# EAGLE design Kenbak-nanoduino (EAGLE 9.2.0)
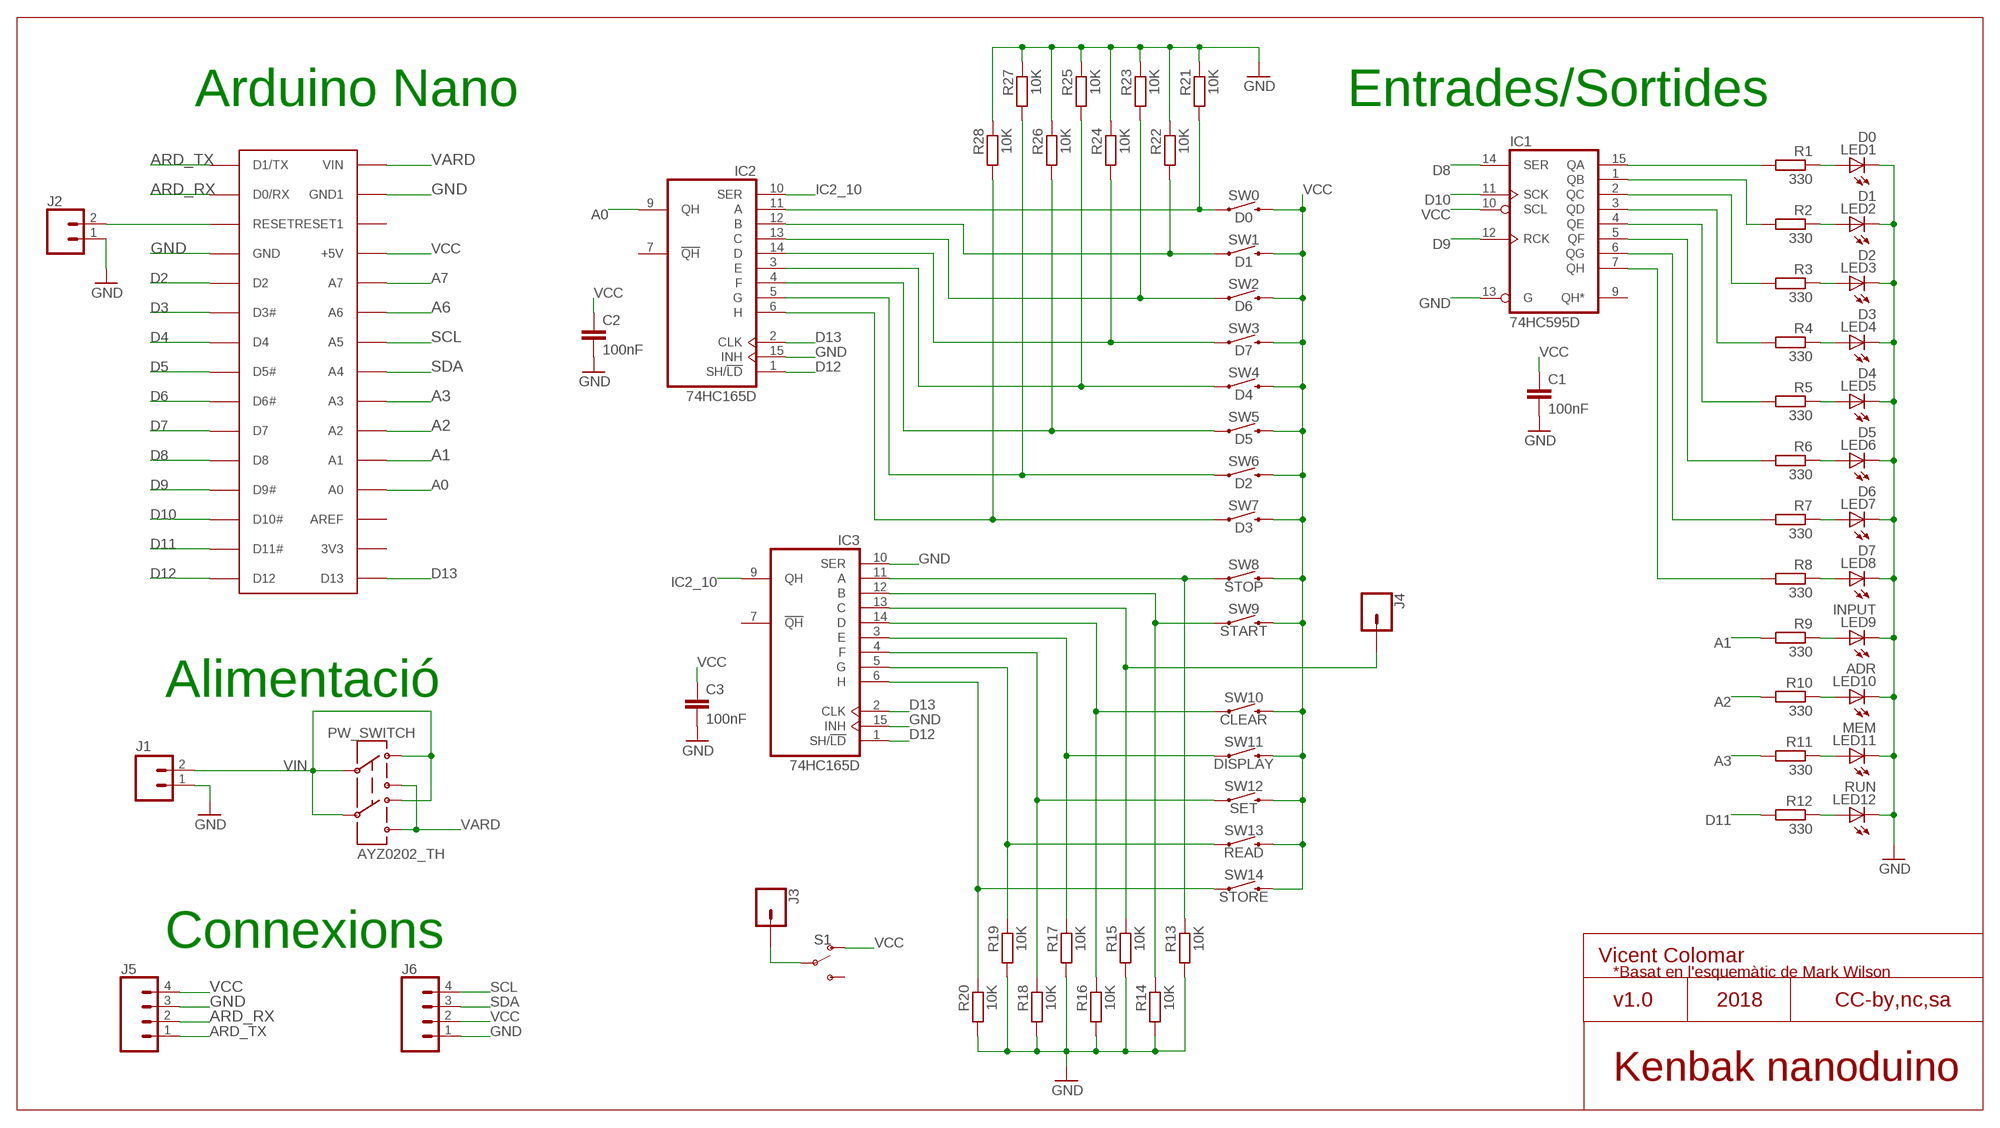
[diagram p0: schematic, sheet 1]

## Parts
ARDUINO  NANO  ARDUINONANONOHOLES  [PDIP-32NOHOLES]
C1  100nF  C-EUC1206  [C1206]
C2  100nF  C-EUC1206  [C1206]
C3  100nF  C-EUC1206  [C1206]
IC1  74HC595D  [SO16]
IC2  74HC165D  [SO16]
IC3  74HC165D  [SO16]
J1  M02LOCK_LONGPADS  [1X02_LOCK_LONGPADS]
J2  CONN_02  [1X02]
J3  CONN_01  [1X01]
J4  CONN_01  [1X01]
J5  CONN_04  [1X04]
J6  CONN_04  [1X04]
LED1  D0  LED3MM  [LED3MM]
LED2  D1  LED3MM  [LED3MM]
LED3  D2  LED3MM  [LED3MM]
LED4  D3  LED3MM  [LED3MM]
LED5  D4  LED3MM  [LED3MM]
LED6  D5  LED3MM  [LED3MM]
LED7  D6  LED3MM  [LED3MM]
LED8  D7  LED3MM  [LED3MM]
LED9  INPUT  LED3MM  [LED3MM]
LED10  ADR  LED3MM  [LED3MM]
LED11  MEM  LED3MM  [LED3MM]
LED12  RUN  LED3MM  [LED3MM]
PW_SWITCH  AYZ0202_TH  [AYZ0202_TH]
R1  330  R-EU_R1206  [R1206]
R2  330  R-EU_R1206  [R1206]
R3  330  R-EU_R1206  [R1206]
R4  330  R-EU_R1206  [R1206]
R5  330  R-EU_R1206  [R1206]
R6  330  R-EU_R1206  [R1206]
R7  330  R-EU_R1206  [R1206]
R8  330  R-EU_R1206  [R1206]
R9  330  R-EU_R1206  [R1206]
R10  330  R-EU_R1206  [R1206]
R11  330  R-EU_R1206  [R1206]
R12  330  R-EU_R1206  [R1206]
R13  10K  R-EU_R1206  [R1206]
R14  10K  R-EU_R1206  [R1206]
R15  10K  R-EU_R1206  [R1206]
R16  10K  R-EU_R1206  [R1206]
R17  10K  R-EU_R1206  [R1206]
R18  10K  R-EU_R1206  [R1206]
R19  10K  R-EU_R1206  [R1206]
R20  10K  R-EU_R1206  [R1206]
R21  10K  R-EU_R1206  [R1206]
R22  10K  R-EU_R1206  [R1206]
R23  10K  R-EU_R1206  [R1206]
R24  10K  R-EU_R1206  [R1206]
R25  10K  R-EU_R1206  [R1206]
R26  10K  R-EU_R1206  [R1206]
R27  10K  R-EU_R1206  [R1206]
R28  10K  R-EU_R1206  [R1206]
S1  SWITCH-SPDT-PTH-11.6X4.0MM  [SWITCH_SPDT_PTH_11.6X4.0MM]
SW0  D0  BOTOPTH  [TACTILE_SWITCH_PTH_6.0X3.5MM]
SW1  D1  BOTOPTH  [TACTILE_SWITCH_PTH_6.0X3.5MM]
SW2  D6  BOTOPTH  [TACTILE_SWITCH_PTH_6.0X3.5MM]
SW3  D7  BOTOPTH  [TACTILE_SWITCH_PTH_6.0X3.5MM]
SW4  D4  BOTOPTH  [TACTILE_SWITCH_PTH_6.0X3.5MM]
SW5  D5  BOTOPTH  [TACTILE_SWITCH_PTH_6.0X3.5MM]
SW6  D2  BOTOPTH  [TACTILE_SWITCH_PTH_6.0X3.5MM]
SW7  D3  BOTOPTH  [TACTILE_SWITCH_PTH_6.0X3.5MM]
SW8  STOP  BOTOPTH  [TACTILE_SWITCH_PTH_6.0X3.5MM]
SW9  START  BOTOPTH  [TACTILE_SWITCH_PTH_6.0X3.5MM]
SW10  CLEAR  BOTOPTH  [TACTILE_SWITCH_PTH_6.0X3.5MM]
SW11  DISPLAY  BOTOPTH  [TACTILE_SWITCH_PTH_6.0X3.5MM]
SW12  SET  BOTOPTH  [TACTILE_SWITCH_PTH_6.0X3.5MM]
SW13  READ  BOTOPTH  [TACTILE_SWITCH_PTH_6.0X3.5MM]
SW14  STORE  BOTOPTH  [TACTILE_SWITCH_PTH_6.0X3.5MM]

## Nets
A0: ARDUINO.A0 IC2.9(QH)
A1: ARDUINO.A1 R9.2
A2: ARDUINO.A2 R10.2
A3: ARDUINO.A3 R11.2
A6: ARDUINO.A6
A7: ARDUINO.A7
ARD_RX: ARDUINO.D0/RX J5.2
ARD_TX: ARDUINO.D1/TX J5.1
D2: ARDUINO.D2
D3: ARDUINO.D3(D3#)
D4: ARDUINO.D4
D5: ARDUINO.D5(D5#)
D6: ARDUINO.D6(D6#)
D7: ARDUINO.D7
D8: ARDUINO.D8 IC1.14(SER)
D9: ARDUINO.D9(D9#) IC1.12(RCK)
D10: ARDUINO.D10(D10#) IC1.11(SCK)
D11: ARDUINO.D11(D11#) R12.2
D12: ARDUINO.D12 IC2.1(SH/!LD) IC3.1(SH/!LD)
D13: ARDUINO.D13 IC2.2(CLK) IC3.2(CLK)
GND: ARDUINO.GND ARDUINO.GND1 C1.2 C2.2 C3.2 IC1.13(G) IC2.15(INH) IC3.10(SER) IC3.15(INH) J1.1 J2.1 J5.3 J6.1 LED1.K(C) LED2.K(C) LED3.K(C) LED4.K(C) LED5.K(C) LED6.K(C) LED7.K(C) LED8.K(C) LED9.K(C) LED10.K(C) LED11.K(C) LED12.K(C) R13.2 R14.2 R15.2 R16.2 R17.2 R18.2 R19.2 R20.2 R21.1 R22.1 R23.1 R24.1 R25.1 R26.1 R27.1 R28.1
IC2_10: IC2.10(SER) IC3.9(QH)
N$1: LED1.A R1.1
N$2: LED2.A R2.1
N$3: LED3.A R3.1
N$4: LED4.A R4.1
N$5: LED5.A R5.1
N$6: LED6.A R6.1
N$7: LED7.A R7.1
N$8: LED8.A R8.1
N$9: LED9.A R9.1
N$10: LED10.A R10.1
N$11: LED11.A R11.1
N$12: LED12.A R12.1
N$13: IC1.15(QA) R1.2
N$14: IC1.1(QB) R2.2
N$15: IC1.2(QC) R3.2
N$16: IC1.3(QD) R4.2
N$17: IC1.4(QE) R5.2
N$18: IC1.5(QF) R6.2
N$19: IC1.6(QG) R7.2
N$20: IC1.7(QH) R8.2
N$21: IC2.11(A) R21.2 SW0.P$1
N$22: IC2.12(B) R22.2 SW1.P$1
N$23: IC2.13(C) R23.2 SW2.P$1
N$24: IC2.14(D) R24.2 SW3.P$1
N$25: J3.1 S1.2(P)
N$26: IC2.3(E) R25.2 SW4.P$1
N$27: IC2.4(F) R26.2 SW5.P$1
N$28: IC2.5(G) R27.2 SW6.P$1
N$29: IC2.6(H) R28.2 SW7.P$1
N$30: IC3.11(A) R13.1 SW8.P$1
N$31: IC3.12(B) R14.1 SW9.P$1
N$32: IC3.13(C) J4.1 R15.1
N$33: IC3.14(D) R16.1 SW10.P$1
N$34: IC3.3(E) R17.1 SW11.P$1
N$35: IC3.4(F) R18.1 SW12.P$1
N$36: IC3.5(G) R19.1 SW13.P$1
N$37: IC3.6(H) R20.1 SW14.P$1
N$38: ARDUINO.RESET J2.2
SCL: ARDUINO.A5 J6.4
SDA: ARDUINO.A4 J6.3
VARD: ARDUINO.VIN PW_SWITCH.B1 PW_SWITCH.B2
VCC: ARDUINO.+5V C1.1 C2.1 C3.1 IC1.10(SCL) J5.4 J6.2 S1.1(O) SW0.P$2 SW1.P$2 SW2.P$2 SW3.P$2 SW4.P$2 SW5.P$2 SW6.P$2 SW7.P$2 SW8.P$2 SW9.P$2 SW10.P$2 SW11.P$2 SW12.P$2 SW13.P$2 SW14.P$2
VIN: J1.2 PW_SWITCH.C1 PW_SWITCH.C2 PW_SWITCH.D1 PW_SWITCH.D2
Unconnected: ARDUINO.3V3 ARDUINO.AREF ARDUINO.RESET1 IC1.9(QH*) IC2.7(!QH) IC3.7(!QH) S1.3(S)

## Notes on the sheet
- Arduino Nano | Entrades/Sortides
- Alimentació
- Connexions
- Vicent Colomar
- *Basat en l'esquemàtic de Mark Wilson
- v1.0 | 2018 | CC-by,nc,sa
- Kenbak nanoduino

## Power pins joined to a net without a drawn wire
GND: IC1.8(GND) IC2.8(GND) IC3.8(GND)
VCC: IC1.16(VCC) IC2.16(VCC) IC3.16(VCC)

## Library data of the parts
ARDUINO = jet-lib:ARDUINONANO
C1-C3 = rcl:C-EU: CAPACITOR, European symbol; SPICEPREFIX: C
IC1 = 74xx-eu:74*595: 8-bit SHIFT REGISTER, output latch
IC2 IC3 = 74xx-eu:74*165: 8-bit parallel load SHIFT REGISTER
J1 = SparkFun:M02: Header 2 Standard 2-pin 0.1" header. Use with straight break away headers (SKU : PRT-00116), right angle break away headers (PRT-00553), swiss pins (PRT-00743), machine pins (PRT-00117), and female headers (PRT-00115). Molex polarized connector foot print use with SKU : PRT-08233 with associated crimp pins and housings.
J2 = SparkFun-Connectors:CONN_02: Multi connection point. Often used as Generic Header-pin footprint for 0.1 inch spaced/style header connections On any of the 0.1 inch spaced packages, you can populate with these: Break Away Headers - Straight <https://www.sparkfun.com/products/116> (PRT-00116) Break Away Male Headers - Right Angle <https://www.sparkfun.com/products/553> (PRT-00553) Female Headers <https://www.sparkfun.com/products/115> (PRT-00115) Break Away Headers - Machine Pin <https://www.sparkfun.com/products/117> (PRT-00117) Break Away Female Headers - Swiss Machine Pin <https://www.sparkfun.com/products/743> (PRT-00743) For SCREWTERMINALS and SPRING TERMINALS visit here: Screw Terimnals on SparkFun.com <https://www.sparkfun.com/search/results?term=Screw+Terminals> (5mm/3.5mm/2.54mm spacing) This device is also useful as a general connection point to wire up your design to another part of your project. Our various solder wires solder well into these plated through hole pads. Hook-Up Wire - Assortment (Stranded, 22 AWG) <https://www.sparkfun.com/products/11375> (PRT-11375) Hook-Up Wire - Assortment (Solid Core, 22 AWG) <https://www.sparkfun.com/products/11367> (PRT-11367) View the entire wire category on our website here <https://www.sparkfun.com/categories/141> Special notes: Molex polarized connector foot print use with: PRT-08233 with associated crimp pins and housings. 2.54_SCREWTERM for use with PRT-10571. 3.5mm Screw Terminal footprints for PRT-08084 5mm Screw Terminal footprints for use with PRT-08432
J3 J4 = SparkFun-Connectors:CONN_01: Single connection point. Often used as Generic Header-pin footprint for 0.1 inch spaced/style header connections On any of the 0.1 inch spaced packages, you can populate with these: Break Away Headers - Straight <https://www.sparkfun.com/products/116> (PRT-00116) Break Away Male Headers - Right Angle <https://www.sparkfun.com/products/553> (PRT-00553) Female Headers <https://www.sparkfun.com/products/115> (PRT-00115) Break Away Headers - Machine Pin <https://www.sparkfun.com/products/117> (PRT-00117) Break Away Female Headers - Swiss Machine Pin <https://www.sparkfun.com/products/743> (PRT-00743) This device is also useful as a general connection point to wire up your design to another part of your project. Our various solder wires solder well into these plated through hole pads. Hook-Up Wire - Assortment (Stranded, 22 AWG) <https://www.sparkfun.com/products/11375> (PRT-11375) Hook-Up Wire - Assortment (Solid Core, 22 AWG) <https://www.sparkfun.com/products/11367> (PRT-11367) View the entire wire category on our website here <https://www.sparkfun.com/categories/141> Special notes: SMTSO-256-ET is a "flush mount" nut for a 4-40 screw. We mostly use this on specialty testbeds; it is a nice way to connect hardware to your PCB at an adjustable hieght. Also note, the SNAP packages are for using a snappable style connector. We sell a baggie of snaps and they are also used on two LilyPad designs: Snap Assortment - 30 pack (male and female) <https://www.sparkfun.com/products/11347> (DEV-11347) LilyPad Arduino SimpleSnap <https://www.sparkfun.com/products/10941> (DEV-10941) LilyPad SimpleSnap Protoboard <https://www.sparkfun.com/products/10940> (DEV-10940)
J5 J6 = SparkFun-Connectors:CONN_04: Multi connection point. Often used as Generic Header-pin footprint for 0.1 inch spaced/style header connections On any of the 0.1 inch spaced packages, you can populate with these: Break Away Headers - Straight <https://www.sparkfun.com/products/116> (PRT-00116) Break Away Male Headers - Right Angle <https://www.sparkfun.com/products/553> (PRT-00553) Female Headers <https://www.sparkfun.com/products/115> (PRT-00115) Break Away Headers - Machine Pin <https://www.sparkfun.com/products/117> (PRT-00117) Break Away Female Headers - Swiss Machine Pin <https://www.sparkfun.com/products/743> (PRT-00743) For SCREWTERMINALS and SPRING TERMINALS visit here: Screw Terimnals on SparkFun.com <https://www.sparkfun.com/search/results?term=Screw+Terminals> (5mm/3.5mm/2.54mm spacing) This device is also useful as a general connection point to wire up your design to another part of your project. Our various solder wires solder well into these plated through hole pads. Hook-Up Wire - Assortment (Stranded, 22 AWG) <https://www.sparkfun.com/products/11375> (PRT-11375) Hook-Up Wire - Assortment (Solid Core, 22 AWG) <https://www.sparkfun.com/products/11367> (PRT-11367) View the entire wire category on our website here <https://www.sparkfun.com/categories/141> Special notes: Molex polarized connector foot print use with SKU : PRT-08231 with associated crimp pins and housings. 1MM SMD Version SKU: PRT-10208; PROD_ID: CONN-09696
LED1-LED12 = led:LED: LED OSRAM: - CHIPLED LG R971, LG N971, LY N971, LG Q971, LY Q971, LO R971, LY R971 LH N974, LH R974 LS Q976, LO Q976, LY Q976 LO Q996 - Hyper CHIPLED LW Q18S LB Q993, LB Q99A, LB R99A - SideLED LS A670, LO A670, LY A670, LG A670, LP A670 LB A673, LV A673, LT A673, LW A673 LH A674 LY A675 LS A676, LA A676, LO A676, LY A676, LW A676 LS A679, LY A679, LG A679 - Hyper Micro SIDELED® LS Y876, LA Y876, LO Y876, LY Y876 LT Y87S - SmartLED LW L88C, LW L88S LB L89C, LB L89S, LG L890 LS L89K, LO L89K, LY L89K LS L896, LA L896, LO L896, LY L896 - TOPLED LS T670, LO T670, LY T670, LG T670, LP T670 LSG T670, LSP T670, LSY T670, LOP T670, LYG T670 LG T671, LOG T671, LSG T671 LB T673, LV T673, LT T673, LW T673 LH T674 LS T676, LA T676, LO T676, LY T676, LB T676, LH T676, LSB T676, LW T676 LB T67C, LV T67C, LT T67C, LS T67K, LO T67K, LY T67K, LW E67C LS E67B, LA E67B, LO E67B, LY E67B, LB E67C, LV E67C, LT E67C LW T67C LS T679, LY T679, LG T679 LS T770, LO T770, LY T770, LG T770, LP T770 LB T773, LV T773, LT T773, LW T773 LH T774 LS E675, LA E675, LY E675, LS T675 LS T776, LA T776, LO T776, LY T776, LB T776 LHGB T686 LT T68C, LB T68C - Hyper Mini TOPLED® LB M676 - Mini TOPLED Santana® LG M470 LS M47K, LO M47K, LY M47K Source: http://www.osram.convergy.de LUXEON: - LUMILED® LXK2-PW12-R00, LXK2-PW12-S00, LXK2-PW14-U00, LXK2-PW14-V00 LXK2-PM12-R00, LXK2-PM12-S00, LXK2-PM14-U00 LXK2-PE12-Q00, LXK2-PE12-R00, LXK2-PE12-S00, LXK2-PE14-T00, LXK2-PE14-U00 LXK2-PB12-K00, LXK2-PB12-L00, LXK2-PB12-M00, LXK2-PB14-N00, LXK2-PB14-P00, LXK2-PB14-Q00 LXK2-PR12-L00, LXK2-PR12-M00, LXK2-PR14-Q00, LXK2-PR14-R00 LXK2-PD12-Q00, LXK2-PD12-R00, LXK2-PD12-S00 LXK2-PH12-R00, LXK2-PH12-S00 LXK2-PL12-P00, LXK2-PL12-Q00, LXK2-PL12-R00 Source: www.luxeon.com KINGBRIGHT: KA-3528ASYC Source: www.kingbright.com
PW_SWITCH = 1r_BAT_guissona:AYZ0202_TH
R1-R28 = resistor:R-EU_: RESISTOR, European symbol
S1 = SparkFun-Switches:SWITCH-SPDT: Single Pole, Double Throw (SPDT) Switch Single-pole, double-throw (SPDT) switch. Variant Overview SMD-AYZ0202 Surface Mount DPDT Switch <https://www.sparkfun.com/products/597> (COM-00597) Used on e.g. LilyPad Arduino USB - ATmega32U4 Board <https://www.sparkfun.com/products/12049> PTH-11.6X4.0MM SPDT Mini Power Switch <https://www.sparkfun.com/products/102> (COM-00102) Used on e.g. SparkFun Simon Says - Through-Hole Soldering Kit <https://www.sparkfun.com/products/10547> (KIT-10547) PTH-11.6X4.0MM-KIT KIT version of SPDT Mini Power Switch - Simplifies soldering by removing tStop of switch pins - only one side can be soldered. PTH-11.6X4.0MM-LOCK LOCK version of SPDT Mini Power Switch - Offset pins hold switch in place for easier soldering. SMD-RIGHT-ANGLE Surface Mount Right Angle Switch <https://www.sparkfun.com/products/10860> (COM-10860) Used on e.g. SparkFun ESP8266 Thing <https://www.sparkfun.com/products/13231>; PROD_ID: SWCH-08261; SF_SKU: COM-00102
SW0 SW1-SW14 = dragonet80:BOTO

## Board
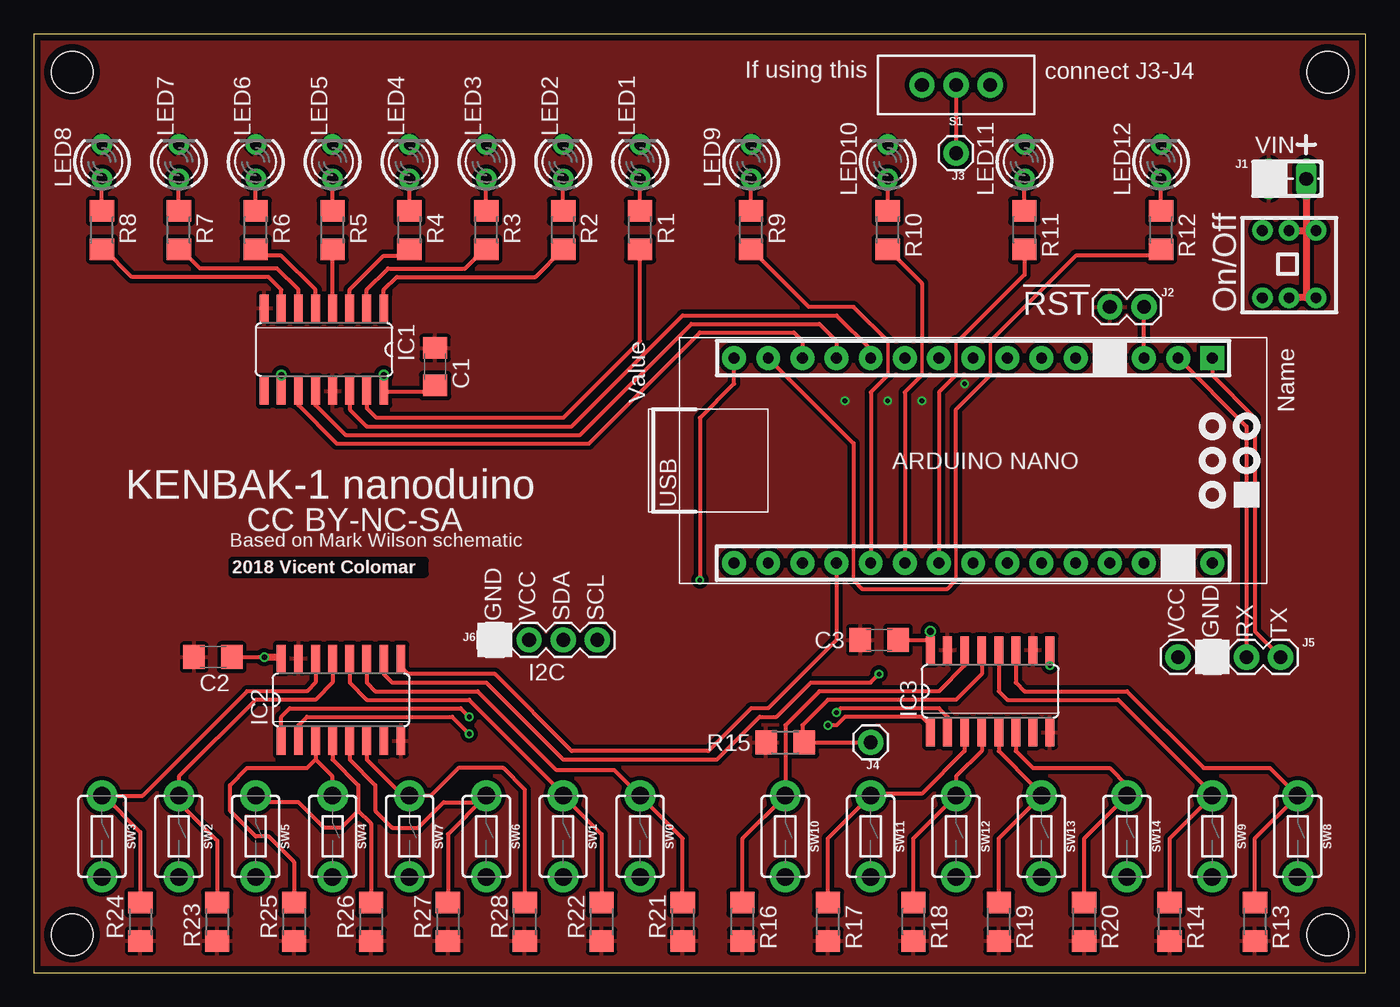
[diagram p1: board, top side]
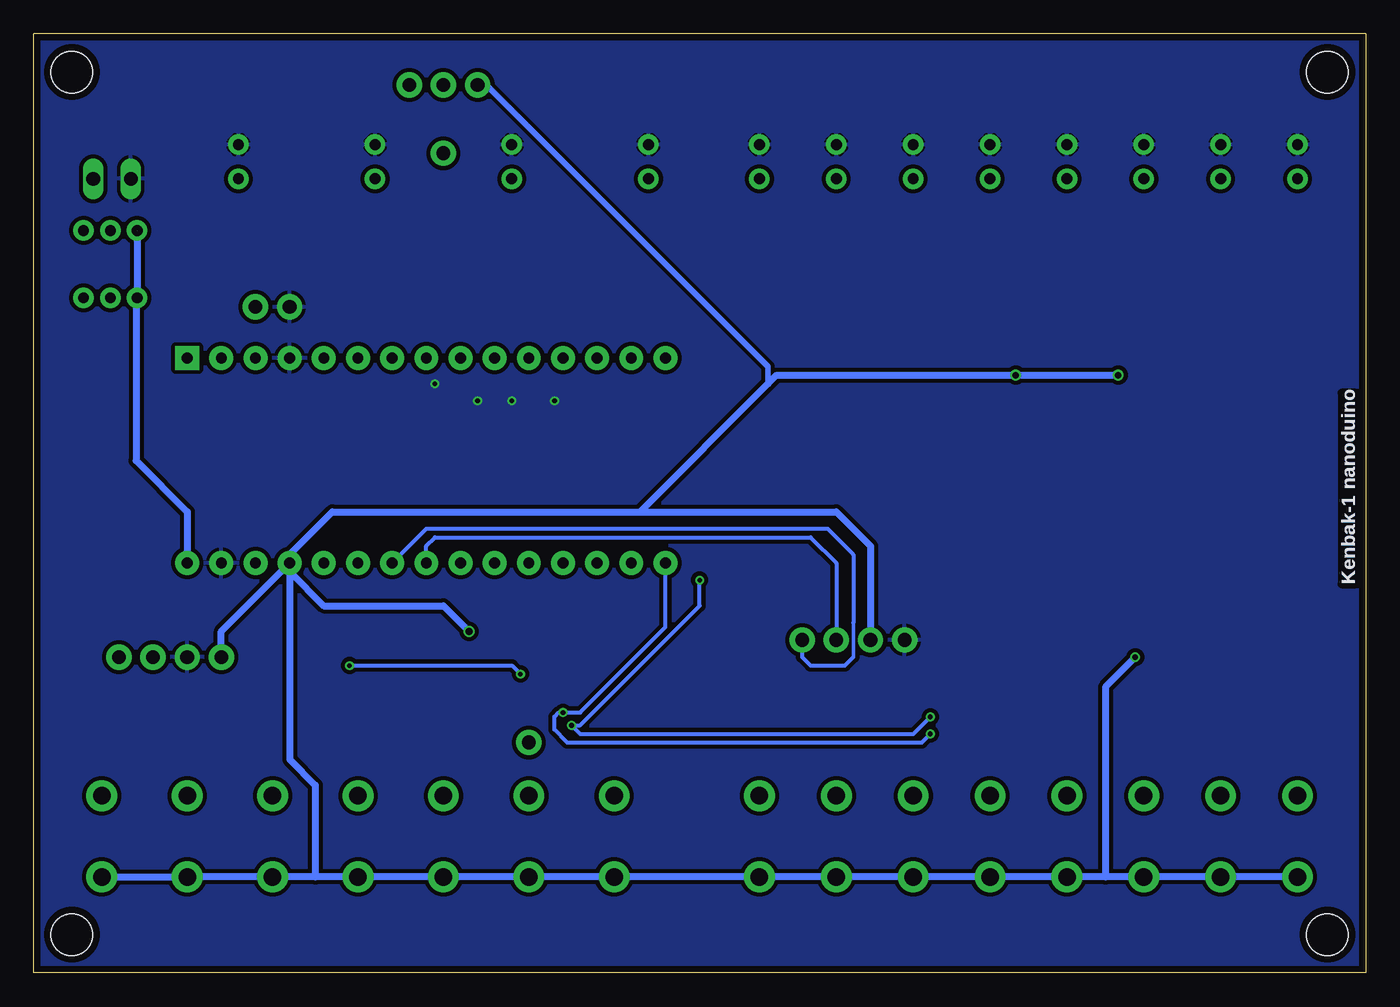
[diagram p2: board, bottom side, seen from below]

Size 99.05 x 69.85 mm. Coordinates in mm from the lower left corner, seen from the top.
Outline: 99.05,69.84 99.05,0 0,0 0,69.84
Outline: 0,69.85 99.05,69.85
Copper layers (1*16): Top 0.035mm / dielectric 1.6mm / Bottom 0.035mm
Design rules "Elecrow_2-layer_PCB_eagle_rule": minimum track width 6mil, minimum drill 12mil, track to track 6mil, track to pad 6mil, pad to pad 6mil, via to via 8mil, smd to smd 0mil, copper to edge 20mil, drill to drill 10mil, minimum pad ring 6mil, minimum via ring 6mil, stop-mask expansion 0mil, vias tented up to drill 100mil, thermal gap 10mil
Holes 3.1 mm at 96.2,66.99 96.2,2.86 2.86,66.99 2.86,2.86

### Footprints (pad centres in the part's own frame; a part is rotated, then mirrored left to right if it is on the bottom)
PDIP-32NOHOLES = drill 0.8 pad 1.778: 3V3 7.62,-15.24; +5V 7.62,10.16; A0 7.62,-10.16; A1 7.62,-7.62; A2 7.62,-5.08; A3 7.62,-2.54; A4 7.62,0; A5 7.62,2.54; A6 7.62,5.08; A7 7.62,7.62; AREF 7.62,-12.7; D0/RX -7.62,15.24; D2 -7.62,7.62; D3 -7.62,5.08; D4 -7.62,2.54; D5 -7.62,0; D6 -7.62,-2.54; D7 -7.62,-5.08; D8 -7.62,-7.62; D9 -7.62,-10.16; D10 -7.62,-12.7; D11 -7.62,-15.24; D12 -7.62,-17.78; D13 7.62,-17.78; GND -7.62,10.16; GND1 7.62,15.24; RESET -7.62,12.7; RESET1 7.62,12.7; VIN 7.62,17.78 | drill 0.8 pad 1.778 square: D1/TX -7.62,17.78
C1206 = smd 1.6 x 1.8: 1 -1.4,0; 2 1.4,0
SO16 = smd 0.66 x 2.032: 1 -4.445,-3.073; 2 -3.175,-3.073; 3 -1.905,-3.073; 4 -0.635,-3.073; 5 0.635,-3.073; 6 1.905,-3.073; 7 3.175,-3.073; 8 4.445,-3.073; 9 4.445,3.073; 10 3.175,3.073; 11 1.905,3.073; 12 0.635,3.073; 13 -0.635,3.073; 14 -1.905,3.073; 15 -3.175,3.073; 16 -4.445,3.073
1X02_LOCK_LONGPADS = drill 1.016 long: 1 -0.127,0; 2 2.667,0
1X02 = drill 1.016 pad 1.88: 1 0,0; 2 2.54,0
1X01 = drill 1.016 pad 1.88: 1 0,0
1X04 = drill 1.016 pad 1.88: 1 0,0; 2 2.54,0; 3 5.08,0; 4 7.62,0
LED3MM = drill 0.813 octagon: A -1.27,0; K 1.27,0
AYZ0202_TH = drill 0.8: B1 -2.5,-2; B2 2.5,-2; C1 -2.5,0; C2 2.5,0; D1 -2.5,2; D2 2.5,2
R1206 = smd 1.6 x 1.803: 1 -1.422,0; 2 1.422,0
SWITCH_SPDT_PTH_11.6X4.0MM = drill 1.016 pad 1.88: 1 0,2.54; 2 0,0; 3 0,-2.54
TACTILE_SWITCH_PTH_6.0X3.5MM = drill 1.3 pad 2.286: P$1 -3.016,0; P$2 3.016,0

### Placement (x,y rotation side)
ARDUINO  69.85,38.11 270 top
C1  29.84,45.09 90 top
C2  13.34,23.5 180 top
C3  62.87,24.77 180 top
IC1  21.59,46.35 180 top
IC2  22.86,20.32 0 top
IC3  71.12,20.95 0 top
J1  91.95,59.05 0 top
J2  80.01,49.53 0 top
J3  68.58,60.96 180 top
J4  62.23,17.14 180 top
J5  92.71,23.5 180 top
J6  34.29,24.77 0 top
LED1  45.09,60.33 90 top
LED2  39.37,60.33 90 top
LED3  33.66,60.33 90 top
LED4  27.94,60.33 90 top
LED5  22.23,60.33 90 top
LED6  16.51,60.33 90 top
LED7  10.79,60.33 90 top
LED8  5.08,60.33 90 top
LED9  53.34,60.33 90 top
LED10  63.5,60.33 90 top
LED11  73.66,60.33 90 top
LED12  83.82,60.33 90 top
PW_SWITCH  93.34,52.7 270 top
R1  45.09,55.24 270 top
R2  39.37,55.24 270 top
R3  33.66,55.24 270 top
R4  27.94,55.24 270 top
R5  22.23,55.24 270 top
R6  16.51,55.24 270 top
R7  10.79,55.24 270 top
R8  5.08,55.24 270 top
R9  53.34,55.24 270 top
R10  63.5,55.24 270 top
R11  73.66,55.24 270 top
R12  83.82,55.24 270 top
R13  90.81,3.81 270 top
R14  84.45,3.81 270 top
R15  55.88,17.14 180 top
R16  52.7,3.81 270 top
R17  59.05,3.81 270 top
R18  65.41,3.81 270 top
R19  71.75,3.81 270 top
R20  78.11,3.81 270 top
R21  48.26,3.81 90 top
R22  42.23,3.81 90 top
R23  13.65,3.81 90 top
R24  7.94,3.81 90 top
R25  19.37,3.81 90 top
R26  25.08,3.81 90 top
R27  30.8,3.81 90 top
R28  36.51,3.81 90 top
S1  68.58,66.04 90 top
SW0  45.09,10.16 270 top
SW1  39.37,10.16 270 top
SW2  10.79,10.16 270 top
SW3  5.08,10.16 270 top
SW4  22.23,10.16 270 top
SW5  16.51,10.16 270 top
SW6  33.66,10.16 270 top
SW7  27.94,10.16 270 top
SW8  93.98,10.16 270 top
SW9  87.63,10.16 270 top
SW10  55.88,10.16 270 top
SW11  62.23,10.16 270 top
SW12  68.58,10.16 270 top
SW13  74.93,10.16 270 top
SW14  81.28,10.16 270 top

### Tracks (layer width: path | path; a pad name or v marks a point on that pad's centre or on a via)
A0
  Top 0.305: ARDUINO.A0 59.69,24.77 57.15,22.23 54.61,19.68 53.34,19.68 50.16,16.51 40.01,16.51 34.29,22.23 27.84,22.23 27.3,22.76 IC2.9
A1
  Top 0.254: 63.5,46.99 63.5,44.45
  Top 0.305: R9.2 57.63,49.53 60.96,49.53 63.5,46.99 | 63.5,44.45 62.23,43.18 ARDUINO.A1
A2
  Top 0.254: 66.04,46.99 66.04,44.45
  Top 0.305: R10.2 66.04,51.28 66.04,46.99 | 66.04,44.45 64.77,43.18 ARDUINO.A2
A3
  Top 0.254: 68.58,46.99 68.58,44.45
  Top 0.305: R11.2 73.66,51.92 68.73,46.99 68.58,46.99 | 68.58,44.45 67.31,43.18 ARDUINO.A3
ARD_RX
  Top 0.305: ARDUINO.D0/RX 85.09,45.72 90.17,40.64 J5.2
ARD_TX
  Top 0.305: ARDUINO.D1/TX 87.63,44.45 90.81,41.27 90.81,25.4 J5.1
D8
  Top 0.305: IC1.14 23.5,41.91 24.77,40.64 40.01,40.64 48.26,48.9 59.69,48.9 62.23,46.35 ARDUINO.D8
D9
  Top 0.305: IC1.12 20.95,42.23 23.18,40.01 40.64,40.01 48.9,48.26 58.42,48.26 59.69,46.99 ARDUINO.D9
D10
  Top 0.305: ARDUINO.D10 57.15,46.99 56.52,47.62 49.53,47.62 41.27,39.37 22.54,39.37 19.68,42.23 IC1.11
D11
  Top 0.254: 60.96,31.75 60.96,29.21 | 68.58,29.21 68.58,31.75 | 71.12,44.45 71.12,46.99
  Top 0.305: ARDUINO.D11 60.96,39.38 60.96,31.75 | 60.96,29.21 61.59,28.57 67.94,28.57 68.58,29.21 | 68.58,31.75 68.58,41.91 71.12,44.45 | 71.12,46.99 77.47,53.34 83.34,53.34 R12.2
D12  (via drill 0.35)
  Top 0.305: IC3.1 66.67,18.41 66.04,19.05 60.33,19.05 59.69,18.41 v59.05,18.41 | ARDUINO.D12 52.07,43.81 49.53,41.27 v49.53,29.21 | IC2.1 18.41,19.05 19.05,19.68 31.75,19.68 v32.38,19.05
  Bottom 0.305: v49.53,29.21 49.53,27.3 58.42,18.41 v59.05,18.41 58.42,17.78 33.66,17.78 v32.38,19.05
D13  (via drill 0.35)
  Top 0.305: IC3.2 67.94,19.05 67.31,19.68 60.01,19.68 v59.69,19.37 | IC2.2 19.68,18.41 20.32,19.05 31.11,19.05 v32.38,17.78
  Bottom 0.305: ARDUINO.D13 52.07,25.71 58.42,19.37 v59.69,19.37 60.01,19.37 60.33,19.05 60.33,18.1 59.37,17.14 33.02,17.14 v32.38,17.78
GND  (via drill 0.35, 0.75 pad 1.52)
  other vias: 83.82,61.59 73.66,61.59 63.5,61.59 53.34,61.59 45.09,61.59 39.37,61.59 33.66,61.59 27.94,61.59 22.23,61.59 16.51,61.59 10.79,61.59 5.08,61.59 60.33,42.55 63.5,42.55 66.04,42.55 69.22,43.81
  pour Bottom (isolate 0.305): 0,0 99.06,0 99.06,69.85 0,69.85
  pour Top (isolate 0.305): 0,0 99.06,0 99.06,69.85 0,69.85
IC2_10  (via drill 0.35)
  Top 0.305: IC2.10 26.04,22.23 26.67,21.59 33.66,21.59 39.37,15.88 50.8,15.88 53.98,19.05 55.24,19.05 57.78,21.59 62.22,21.59 v62.85,22.23 | v75.56,22.86 IC3.9
  Bottom 0.305: v75.56,22.86 63.49,22.86 v62.85,22.23
N$1  (via drill 0.75 pad 1.52)
  Top 0.305: R1.1 LED1.A
  other vias: 45.09,59.05
N$2  (via drill 0.75 pad 1.52)
  Top 0.305: R2.1 LED2.A
  other vias: 39.37,59.05
N$3  (via drill 0.75 pad 1.52)
  Top 0.305: R3.1 LED3.A
  other vias: 33.66,59.05
N$4  (via drill 0.75 pad 1.52)
  Top 0.305: R4.1 LED4.A
  other vias: 27.94,59.05
N$5  (via drill 0.75 pad 1.52)
  Top 0.305: R5.1 LED5.A
  other vias: 22.23,59.05
N$6  (via drill 0.75 pad 1.52)
  Top 0.305: R6.1 LED6.A
  other vias: 16.51,59.05
N$7  (via drill 0.75 pad 1.52)
  Top 0.305: R7.1 LED7.A
  other vias: 10.79,59.05
N$8  (via drill 0.75 pad 1.52)
  Top 0.305: R8.1 LED8.A
  other vias: 5.08,59.05
N$9  (via drill 0.75 pad 1.52)
  Top 0.305: R9.1 LED9.A
  other vias: 53.34,59.05
N$10  (via drill 0.75 pad 1.52)
  Top 0.305: R10.1 LED10.A
  other vias: 63.5,59.05
N$11  (via drill 0.75 pad 1.52)
  Top 0.305: R11.1 LED11.A
  other vias: 73.66,59.05
N$12  (via drill 0.75 pad 1.52)
  Top 0.305: R12.1 LED12.A
  other vias: 83.82,59.05
N$13
  Top 0.305: R1.2 45.09,46.99 39.37,41.27 25.5,41.27 24.77,42.01 IC1.15
N$14
  Top 0.305: IC1.1 26.04,50.8 26.99,51.75 37.3,51.75 R2.2
N$15
  Top 0.305: IC1.2 24.77,50.8 26.35,52.39 32.07,52.39 33.5,53.82 R3.2
N$16
  Top 0.305: IC1.3 23.5,50.8 26.04,53.34 27.46,53.34 R4.2
N$17
  Top 0.305: IC1.4 R5.2
N$18
  Top 0.305: IC1.5 20.95,50.8 18.41,53.34 16.99,53.34 R6.2
N$19
  Top 0.305: IC1.6 19.68,50.8 18.1,52.39 12.38,52.39 10.95,53.82 R7.2
N$20
  Top 0.305: IC1.7 18.41,50.8 17.46,51.75 7.3,51.75 5.23,53.82 R8.2
N$21
  Top 0.305: IC2.11 24.77,21.59 25.4,20.95 33.02,20.95 38.89,15.08 43.18,15.08 SW0.P$1 48.26,10 R21.2
N$22
  Top 0.305: IC2.12 23.5,21.59 24.77,20.32 32.38,20.32 39.37,13.34 SW1.P$1 42.23,10.32 R22.2
N$23
  Top 0.305: IC2.13 22.23,21.59 20.95,20.32 16.51,20.32 10.79,14.61 SW2.P$1 10.79,12.7 13.65,9.84 R23.2
N$24
  Top 0.305: IC2.14 20.95,21.59 20.32,20.95 15.88,20.95 8.1,13.18 SW3.P$1 5.24,13.18 7.94,10.48 R24.2
N$25
  Top 0.305: S1.2 J3.1
N$26
  Top 0.305: IC2.3 20.95,15.88 | 20.95,15.88 22.23,14.61 SW4.P$1 | R25.2 19.37,8.26 17.46,10.16 16.51,10.16 14.61,12.06 14.61,13.97 15.88,15.24 20.32,15.24 20.95,15.88
N$27
  Top 0.305: IC2.4 22.23,15.88 24.13,13.97 24.13,12.06 | 24.13,12.06 22.86,10.79 21.59,10.79 19.68,12.7 17.62,12.7 17.14,13.18 SW5.P$1 | R26.2 25.08,11.11 24.13,12.06
N$28
  Top 0.305: IC2.5 23.5,15.88 25.4,13.97 25.4,12.06 26.67,10.79 28.57,10.79 30.48,12.7 33.18,12.7 SW6.P$1 30.8,10.32 R27.2
N$29
  Top 0.305: IC2.6 24.77,15.88 27.46,13.18 SW7.P$1 29.53,13.18 31.59,15.24 34.92,15.24 36.51,13.65 R28.2
N$30
  Top 0.305: IC3.11 73.03,21.59 73.66,20.95 81.28,20.95 87,15.24 91.92,15.24 SW8.P$1 90.81,10 R13.1
N$31
  Top 0.305: IC3.12 71.75,20.95 72.39,20.32 80.64,20.32 87.63,13.34 SW9.P$1 84.45,10 R14.1
N$32
  Top 0.305: IC3.13 70.48,22.23 68.58,20.32 59.05,20.32 57.15,18.41 57.15,17.3 R15.1 J4.1
N$33
  Top 0.305: IC3.14 69.22,22.86 67.31,20.95 58.42,20.95 55.88,18.41 SW10.P$1 52.7,10 R16.1
N$34
  Top 0.305: IC3.3 69.22,16.51 66.04,13.34 62.39,13.34 SW11.P$1 59.05,10 R17.1
N$35
  Top 0.305: IC3.4 70.48,16.51 68.58,14.61 SW12.P$1 65.41,10 R18.1
N$36
  Top 0.305: IC3.5 71.75,16.51 74.45,13.81 74.45,13.65 SW13.P$1 71.75,10 R19.1
N$37
  Top 0.305: IC3.6 73.03,16.51 74.3,15.24 80.01,15.24 81.28,13.97 SW14.P$1 78.11,10 R20.1
N$38
  Top 0.305: ARDUINO.RESET J2.2
SCL
  Bottom 0.254: 38.1,26.04 38.1,23.5
  Bottom 0.305: ARDUINO.A5 69.86,33.02 40.01,33.02 38.1,31.11 38.1,26.04 | 38.1,23.5 38.73,22.86 41.27,22.86 41.91,23.5 J6.4
SDA
  Bottom 0.305: ARDUINO.A4 69.85,31.75 69.22,32.38 41.27,32.38 39.37,30.48 J6.3
VARD  (via drill 0.75 pad 1.52)  (1 unrouted)
  Bottom 0.305: v91.35,50.2 v91.36,50.21
  Bottom 0.508: PW_SWITCH.B2 v91.35,50.2 | v91.35,50.2 91.4,50.2 91.44,50.16 91.44,38.1 87.63,34.29 ARDUINO.VIN | PW_SWITCH.B1 91.34,50.21 v91.35,50.2
  other vias: 91.36,55.21
VCC  (via drill 0.4, 0.5)
  Top 0.305: C2.1 v17.14,23.5 | C3.1 66.67,24.77 IC3.16 | C1.1 29.34,43.18 26.14,43.18 IC1.16
  Top 0.508: v66.67,25.4 IC3.16 | v17.14,23.5 18.31,23.5 IC2.16 | v26.04,44.45 IC1.16 | IC1.10 v18.41,44.45
  Bottom 0.305: S1.1 65.41,66.04
  Bottom 0.406: 65.41,66.04 44.45,45.09 44.45,43.81
  Bottom 0.508: SW5.P$2 19.37,7.14 19.37,21.27 v17.14,23.5 | SW5.P$2 SW2.P$2 SW3.P$2 | SW5.P$2 SW4.P$2 SW7.P$2 SW6.P$2 SW1.P$2 SW0.P$2 SW10.P$2 SW11.P$2 SW12.P$2 SW13.P$2 78.11,7.14 | 78.11,7.14 SW14.P$2 SW9.P$2 SW8.P$2 | ARDUINO.+5V 80.01,29.85 | 80.01,29.85 77.47,27.3 68.58,27.3 v66.67,25.4 | ARDUINO.+5V 80.01,31.12 76.84,34.29 53.98,34.29 | 80.01,29.85 80.01,15.88 78.11,13.97 78.11,7.14 | 53.98,34.29 39.37,34.29 36.83,31.75 J6.2 | v18.41,44.45 v26.04,44.45 43.81,44.45 44.45,43.81 53.98,34.29 | J5.4 85.09,25.4 ARDUINO.+5V
VIN  (via drill 0.75 pad 1.52)
  Top 0.305: PW_SWITCH.C1 v93.34,55.21 | PW_SWITCH.D1 v95.33,55.2 v95.33,55.21 | PW_SWITCH.D2 v95.33,50.2 v95.33,50.21 | PW_SWITCH.C2 v93.34,50.21
  Top 0.508: PW_SWITCH.D1 94.61,55.2 | PW_SWITCH.C1 94.61,55.2 | PW_SWITCH.D2 94.61,50.2 | 94.61,50.2 PW_SWITCH.C2 | 94.61,55.2 94.61,50.2 | J1.2 94.61,55.2

### Text on the board
Top: 2018 Vicent Colomar
Bottom: Kenbak-1 nanoduino
tPlace: 2018 Vicent Colomar
bPlace: Kenbak-1 nanoduino
_tsilk: If using this | connect J3-J4 | VIN | !RST | On/Off | ARDUINO NANO | KENBAK-1 nanoduino | CC BY-NC-SA | USB | Based on Mark Wilson schematic | GND | VCC | SDA | SCL | VCC | GND | RX | TX | I2C